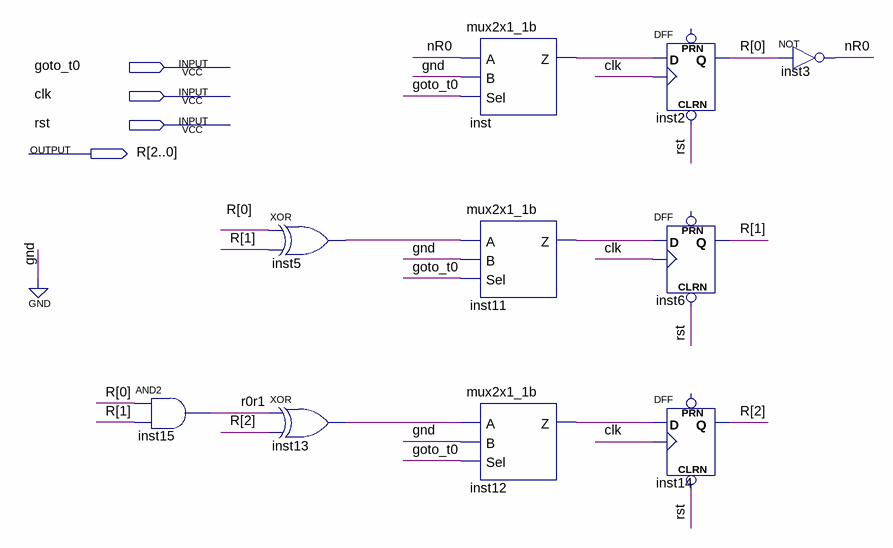
[diagram p0: schematic sheet]
// Quartus schematic contador4b.bdf as structural Verilog: 10 symbols, 4 pins
module contador4b (
  input  goto_t0,
  input  clk,
  input  rst,
  output [2:0] R
);

  wire inst5_out, inst11_z, inst12_z, inst13_out, inst_z, nR0, r0r1;

  and inst15 (r0r1, R[0], R[1]);
  xor inst5 (inst5_out, R[0], R[1]);
  xor inst13 (inst13_out, r0r1, R[2]);
  mux2x1_1b inst (.A(nR0), .B(1'b0), .Sel(goto_t0), .Z(inst_z));
  mux2x1_1b inst11 (.A(inst5_out), .B(1'b0), .Sel(goto_t0), .Z(inst11_z));
  mux2x1_1b inst12 (.A(inst13_out), .B(1'b0), .Sel(goto_t0), .Z(inst12_z));
  DFF inst2 (.CLRN(rst), .CLK(clk), .D(inst_z), .Q(R[0]));  // open: PRN
  DFF inst6 (.CLRN(rst), .CLK(clk), .D(inst11_z), .Q(R[1]));  // open: PRN
  DFF inst14 (.CLRN(rst), .CLK(clk), .D(inst12_z), .Q(R[2]));  // open: PRN
  not inst3 (nR0, R[0]);
endmodule
